# EAGLE schematic schematic (EAGLE 6.5.0)
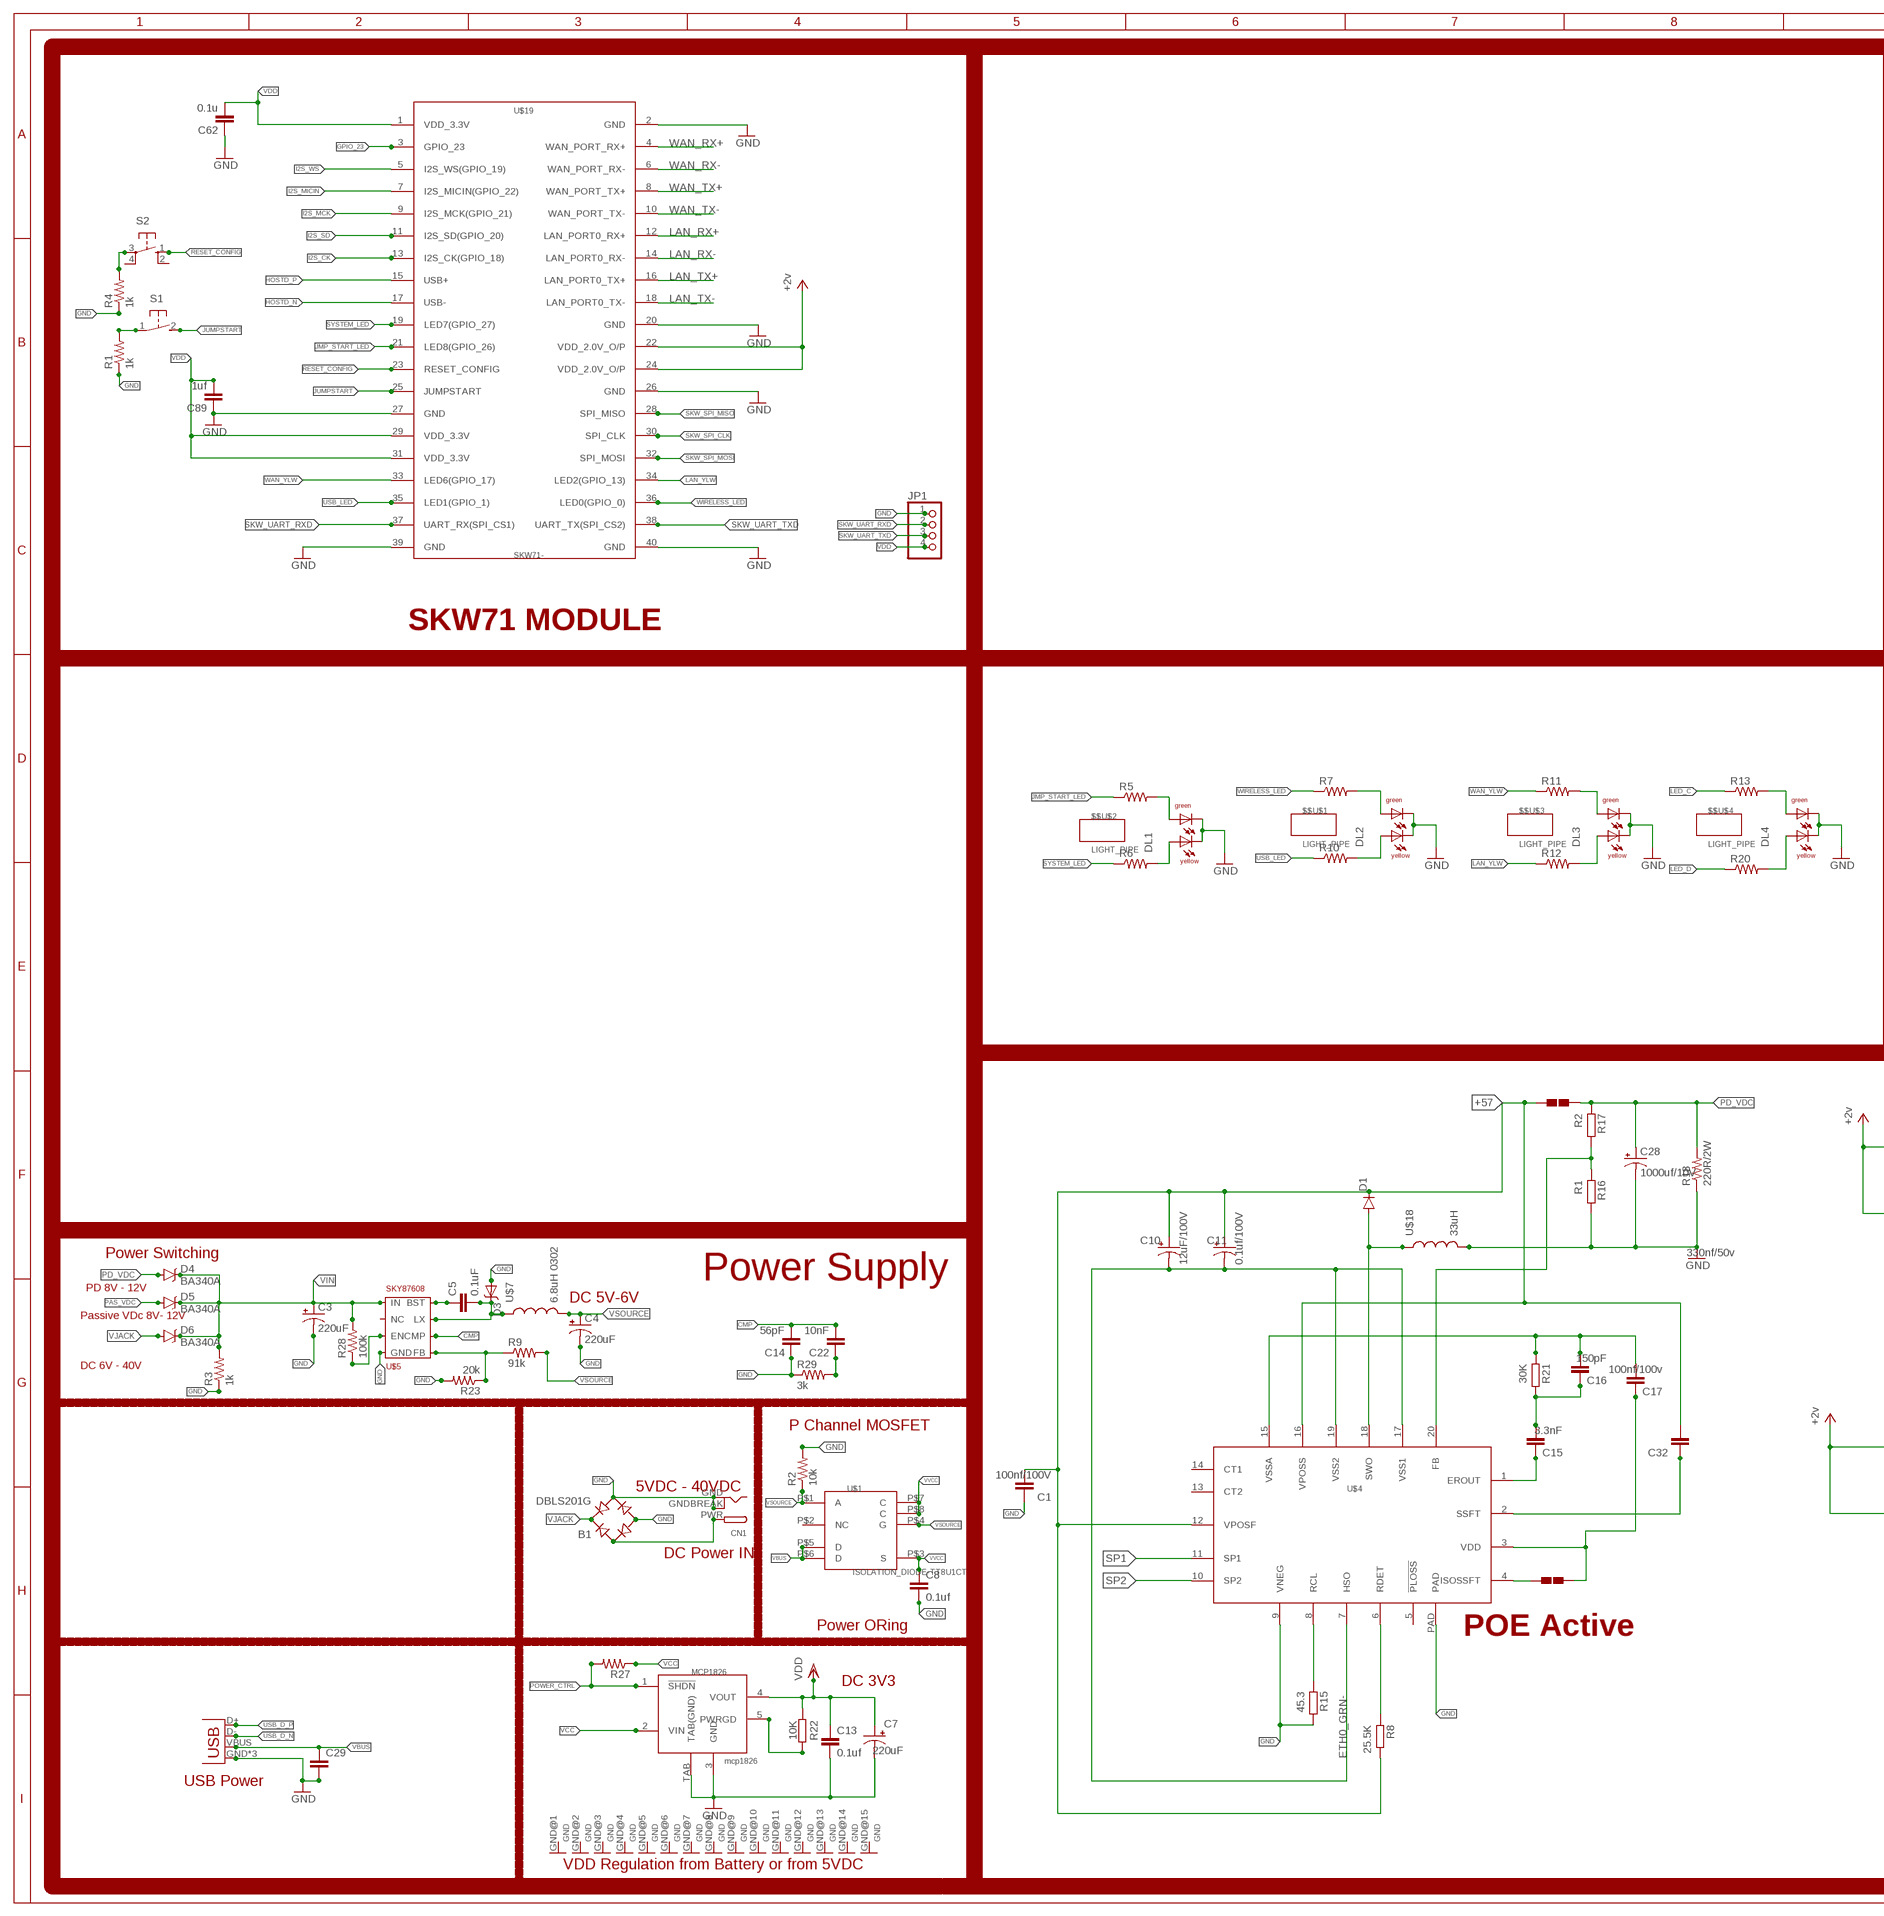
[diagram p0: schematic, sheet 1, part 1 of 2]
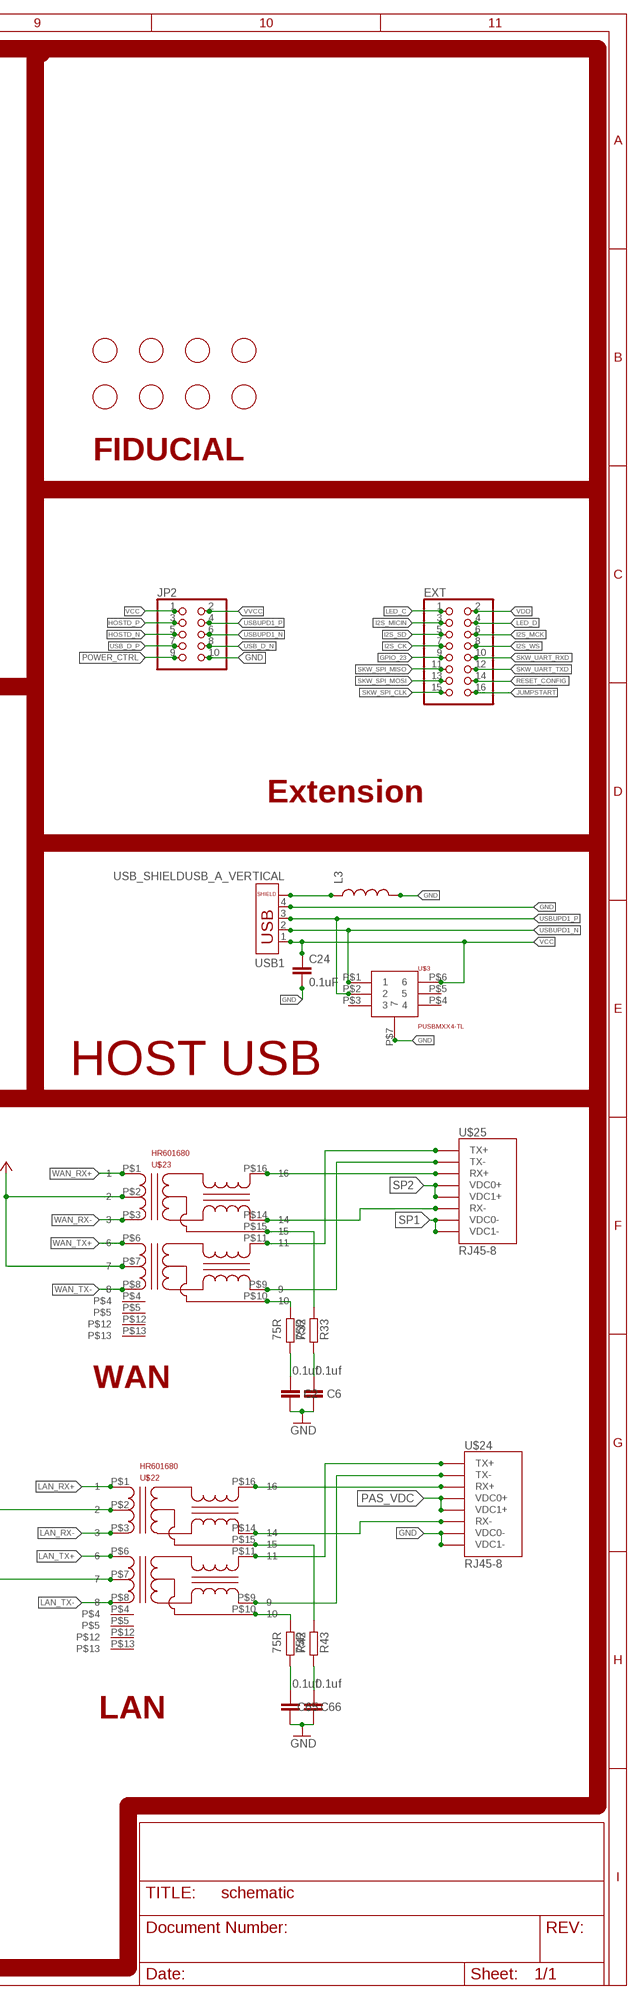
[diagram p1: schematic, sheet 1, part 2 of 2]

## Parts
$$U$1  LIGHT_PIPE  [LIGHT-PIPE]
$$U$2  LIGHT_PIPE  [LIGHT-PIPE]
$$U$3  LIGHT_PIPE  [LIGHT-PIPE]
$$U$4  LIGHT_PIPE  [LIGHT-PIPE]
B1  DBLS201G  [DBS]
C1  100nf/100V  C-EUC0805  [C0805]
C2  0.1uf  CAPACITOR  [C0603]
C3  220uF  CPOL-USE3.5-10  [E3,5-10]
C4  220uF  CPOL-USE5-10.5  [E5-10,5]
C5  0.1uF  CAP0402-CAP  [0402-CAP]
C6  0.1uf  CAPACITOR  [C0603]
C7  220uF  CPOL-USE5-10.5  [E5-10,5]
C8  0.1uf  C-EUC0402  [C0402]
C10  12uF/100V  CPOL-USE2,5-6E  [E2,5-6E]
C11  0.1uf/100V  CPOL-USE2-5  [E2-5]
C13  0.1uf  C-EUC0402  [C0402]
C14  56pF  CAP0402-CAP  [0402-CAP]
C15  3.3nF  C-EUC0805  [C0805]
C16  150pF  C-EUC0805  [C0805]
C17  100nf/100v  C-EUC0805  [C0805]
C22  10nF  CAP0402-CAP  [0402-CAP]
C24  0.1uF  CAP0402-CAP  [0402-CAP]
C28  1000uf/10V  CPOL-USE5-13  [E5-13]
C29  CAP0402-CAP  [0402-CAP]
C32  330nf/50v  C-EUC0805  [C0805]
C62  0.1u  CAPACITOR  [C0603]
C65  0.1uf  CAPACITOR  [C0603]
C66  0.1uf  CAPACITOR  [C0603]
C89  1uf  CAPACITOR  [C0603]
CN1  DCBARRELPTH  [DCJACK_2MM_PTH]
D1  DIODESMC/DO-214AB  [SMC]
D3  DIODE-SCHOTTKY_  [SMA-DIODE]
D4  BA340A  B340A  [SMA-DIODE]
D5  BA340A  B340A  [SMA-DIODE]
D6  BA340A  B340A  [SMA-DIODE]
DL1  DUOLED-1X2  [DUOLED-C-0603]
DL2  DUOLED-1X2  [DUOLED-C-0603]
DL3  DUOLED-1X2  [DUOLED-C-0603]
DL4  DUOLED-1X2  [DUOLED-C-0603]
EXT  PINHD-2X8  [2X08]
JP1  PINHD-1X4  [1X04]
JP2  PINHD-2X5  [2X05]
JP4  USB-MICROB  [USB-MICROB]
L3  INDUCTOR0402  [C0402]
MCP1826  mcp1826  MCP1825T  [SOT223-5]
R1  1k  RESISTOR0402-RES  [0402-RES]
R2  10k  RESISTOR0402-RES  [0402-RES]
R3  1k  RESISTOR0402-RES  [0402-RES]
R4  1k  RESISTOR0402-RES  [0402-RES]
R5  RESISTOR0402-RES  [0402-RES]
R6  RESISTOR0402-RES  [0402-RES]
R7  RESISTOR0402-RES  [0402-RES]
R8  25.5K  RESISTOR  [R0603]
R9  91k  RESISTOR0402-RES  [0402-RES]
R10  RESISTOR0402-RES  [0402-RES]
R11  RESISTOR0402-RES  [0402-RES]
R12  RESISTOR0402-RES  [0402-RES]
R13  RESISTOR0402-RES  [0402-RES]
R15  45.3  RESISTOR  [R0603]
R16  R1  RESISTOR  [R0603]
R17  R2  RESISTOR  [R0603]
R18  220R/2W  R-US_R2512  [R2512]
R20  RESISTOR0402-RES  [0402-RES]
R21  30K  RESISTOR  [R0603]
R22  10K  R-EU_R0402  [R0402]
R23  20k  RESISTOR0402-RES  [0402-RES]
R27  RESISTOR0402-RES  [0402-RES]
R28  100k  RESISTOR0402-RES  [0402-RES]
R29  3k  RESISTOR0402-RES  [0402-RES]
R32  75R  RESISTOR  [R0603]
R33  75R  RESISTOR  [R0603]
R42  75R  RESISTOR  [R0603]
R43  75R  RESISTOR  [R0603]
S1  31-XX  [B3F-31XX]
S2  10-XX  [B3F-10XX]
U$1  ISOLATION_DIODE-TT8U1CT  [8-TSST]
U$3  PUSBMXX4-TL  [PUSBMXX4-TL]
U$4  SI3402  [SI3402]
U$5  SKY87608  [8PIN-SOP-8L-EP]
U$7  6.8uH 0302  INDUCTORBOURNS_SRN6045  [SRN6045]
U$9  FIDUCIAL  [FIDUCIAL_1MM]
U$10  SOL-PAD-OPEN  [SOL-PAD-OPEN]
U$11  FIDUCIAL  [FIDUCIAL_1MM]
U$12  FIDUCIAL  [FIDUCIAL_1MM]
U$13  FIDUCIAL  [FIDUCIAL_1MM]
U$14  FIDUCIAL  [FIDUCIAL_1MM]
U$15  FIDUCIAL  [FIDUCIAL_1MM]
U$16  FIDUCIAL  [FIDUCIAL_1MM]
U$17  FIDUCIAL  [FIDUCIAL_1MM]
U$18  33uH  INDUCTOR  [INDUCTOR-10X9.8X6]
U$19  SKW71-  [SKW71-SMT]
U$22  HR601680  [SOIC-16]
U$23  HR601680  [SOIC-16]
U$24  RJ45-8  [RJHSE-5080-ND]
U$25  RJ45-8  [RJHSE-5080-ND]
U$28  SOL-PAD-OPEN  [SOL-PAD-OPEN]
USB1  USB_SHIELDUSB_A_VERTICAL  [USB_A_VERTICAL_PTH]

## Nets
+2V [power]: U$19.22(VDD_2.0V_O/P) U$19.24(VDD_2.0V_O/P) U$22.P$2 U$22.P$7 U$23.P$2 U$23.P$7 ; supply symbol labelled +2v
+57 [power]: C1.2 C10.+ C11.+ C32.2 D1.C R8.2 U$4.12(VPOSF) U$4.16(VPOSS) U$28.P$1
CMP: C14.2 C22.2 U$5.P$6(CMP)
ETH0_GRN-: C10.- C11.- U$4.7(HSO) U$4.17(VSS1) U$4.19(VSS2)
GND: B1.- B1.AC2 C1.1 C2.1 C3.- C4.- C6.1 C7.- C8.2 C13.2 C14.1 C24.2 C28.- C29.2 C62.1 C65.1 C66.1 C89.1 CN1.GND CN1.GNDBREAK D3.A DL1.C1 DL1.C2 DL2.C1 DL2.C2 DL3.C1 DL3.C2 DL4.C1 DL4.C2 JP1.1 JP2.10 JP4.GND JP4.MT1(GND) JP4.MT2(GND) L3.2 MCP1826.3(GND) MCP1826.TAB(TAB(GND)) R1.1 R2.2 R3.1 R4.1 R15.2 R16.2 R18.1 R23.2 R29.1 U$3.P$7 U$4.9(VNEG) U$4.PAD U$5.P$4(GND) U$18.P$2 U$19.2(GND) U$19.20(GND) U$19.26(GND) U$19.27(GND) U$19.39(GND) U$19.40(GND) U$24.P$7(VDC0-) U$24.P$8(VDC1-) USB1.4
GPIO_23: EXT.9 U$19.3(GPIO_23)
HOSTD_N: JP2.5 U$19.17(USB-)
HOSTD_P: JP2.3 U$19.15(USB+)
I2S_CK: EXT.7 U$19.13(I2S_CK(GPIO_18))
I2S_MCK: EXT.6 U$19.9(I2S_MCK(GPIO_21))
I2S_MICIN: EXT.3 U$19.7(I2S_MICIN(GPIO_22))
I2S_SD: EXT.5 U$19.11(I2S_SD(GPIO_20))
I2S_WS: EXT.8 U$19.5(I2S_WS(GPIO_19))
JMP_START_LED: R5.1 U$19.21(LED8(GPIO_26))
JUMPSTART: EXT.16 S1.2(S) U$19.25(JUMPSTART)
LAN_RX+: U$19.12(LAN_PORT0_RX+) U$22.P$1
LAN_RX-: U$19.14(LAN_PORT0_RX-) U$22.P$3
LAN_TX+: U$19.16(LAN_PORT0_TX+) U$22.P$6
LAN_TX-: U$19.18(LAN_PORT0_TX-) U$22.P$8
LAN_YLW: R12.1 U$19.34(LED2(GPIO_13))
LED_C: EXT.1 R13.1
LED_D: EXT.4 R20.1
N$1: DL2.A1 R7.2
N$2: C5.2 D3.C U$5.P$2(LX) U$7.1
N$3: DL1.A1 R5.2
N$4: DL2.A2 R10.2
N$5: R1.2 S1.1(P)
N$6: C16.2 C17.2 R21.1 U$4.15(VSSA)
N$7: C15.2 C16.1 R21.2
N$8: R8.1 U$4.6(RDET)
N$9: R15.1 U$4.8(RCL)
N$10: R4.2 S2.3(P)
N$11: U$4.4(ISOSSFT) U$10.P$1
N$12: C17.1 U$4.3(VDD) U$10.P$2
N$13: C15.1 U$4.1(EROUT)
N$15: C32.1 U$4.2(SSFT)
N$16: R16.1 R17.2 U$4.20(FB)
N$17: DL3.A2 R12.2
N$19: DL4.A1 R13.2
N$20: MCP1826.5(PWRGD) R22.2
N$22: R28.1 U$5.P$7(EN)
N$26: C5.1 U$5.P$8(BST)
N$27: R9.1 R23.1 U$5.P$5(FB)
N$29: DL4.A2 R20.2
N$35: DL3.A1 R11.2
N$37: C22.1 R29.2
N$38: D1.A U$4.18(SWO) U$18.P$1
N$40: DL1.A2 R6.2
N$41: L3.1 USB1.P$3
N$43: C2.2 R32.2
N$44: B1.AC1 CN1.PWR
N$45: C6.2 R33.2
N$48: U$23.P$16 U$25.P$3(RX+)
N$49: U$23.P$14 U$25.P$6(RX-)
N$50: R33.1 U$23.P$15
N$51: U$23.P$11 U$25.P$1(TX+)
N$52: U$23.P$9 U$25.P$2(TX-)
N$53: R32.1 U$23.P$10
N$54: R42.1 U$22.P$10
N$55: U$22.P$9 U$24.P$2(TX-)
N$56: U$22.P$11 U$24.P$1(TX+)
N$57: R43.1 U$22.P$15
N$58: U$22.P$14 U$24.P$6(RX-)
N$59: U$22.P$16 U$24.P$3(RX+)
N$69: C65.2 R42.2
N$70: C66.2 R43.2
PAS_VDC: D5.A U$24.P$4(VDC0+) U$24.P$5(VDC1+)
PD_VDC: C28.+ D4.A R17.1 R18.2 U$28.P$2
POWER_CTRL: JP2.9 MCP1826.1(!SHDN) R27.2
RESET_CONFIG: EXT.14 S2.1(S) U$19.23(RESET_CONFIG)
SKW_SPI_CLK: EXT.15 U$19.30(SPI_CLK)
SKW_SPI_MISO: EXT.11 U$19.28(SPI_MISO)
SKW_SPI_MOSI: EXT.13 U$19.32(SPI_MOSI)
SKW_UART_RXD: EXT.10 JP1.2 U$19.37(UART_RX(SPI_CS1))
SKW_UART_TXD: EXT.12 JP1.3 U$19.38(UART_TX(SPI_CS2))
SP1: U$4.11(SP1) U$25.P$7(VDC0-) U$25.P$8(VDC1-)
SP2: U$4.10(SP2) U$25.P$4(VDC0+) U$25.P$5(VDC1+)
SYSTEM_LED: R6.1 U$19.19(LED7(GPIO_27))
USB_D_N: JP2.8 JP4.D-
USB_D_P: JP2.7 JP4.D+
USB_LED: R10.1 U$19.35(LED1(GPIO_1))
USBUPD1_N: JP2.6 U$3.P$1 USB1.2
USBUPD1_P: JP2.4 U$3.P$2 USB1.3
VBUS: C29.1 JP4.VBUS U$1.P$5(D) U$1.P$6(D)
VCC: C24.1 JP2.1 MCP1826.2(VIN) R27.1 U$3.P$6 USB1.1
VDD: C7.+ C13.1 C62.2 C89.2 EXT.2 JP1.4 MCP1826.4(VOUT) R22.1 U$19.1(VDD_3.3V) U$19.29(VDD_3.3V) U$19.31(VDD_3.3V)
VIN: C3.+ D4.C D5.C D6.C R3.2 R28.2 U$5.P$1(IN)
VJACK: B1.+ D6.A
VSOURCE: C4.+ R2.1 R9.2 U$1.P$1(A) U$1.P$4(G) U$7.2
VVCC: C8.1 JP2.2 U$1.P$3(S) U$1.P$7(C) U$1.P$8(C)
WAN_RX+: U$19.4(WAN_PORT_RX+) U$23.P$1
WAN_RX-: U$19.6(WAN_PORT_RX-) U$23.P$3
WAN_TX+: U$19.8(WAN_PORT_TX+) U$23.P$6
WAN_TX-: U$19.10(WAN_PORT_TX-) U$23.P$8
WAN_YLW: R11.1 U$19.33(LED6(GPIO_17))
WIRELESS_LED: R7.1 U$19.36(LED0(GPIO_0))
Unconnected: S2.2(S1) S2.4(P1) U$1.P$2(NC) U$3.P$3 U$3.P$4 U$3.P$5 U$4.5(!PLOSS) U$4.13(CT2) U$4.14(CT1) U$5.P$3(NC) U$22.P$4 U$22.P$5 U$22.P$12 U$22.P$13 U$23.P$4 U$23.P$5 U$23.P$12 U$23.P$13

## Notes on the sheet
- FIDUCIAL
- SKW71 MODULE
- Extension
- HOST USB
- Power Switching
- Power Supply
- PD 8V - 12V
- DC 5V-6V
- Passive VDc 8V- 12V
- WAN
- DC 6V - 40V
- P Channel MOSFET
- 5VDC - 40VDC
- DC Power IN
- Power ORing
- POE Active
- LAN
- DC 3V3
- USB Power
- VDD Regulation from Battery or from 5VDC

## Power pins joined to a net without a drawn wire
GND: MCP1826.GND@1(GND) MCP1826.GND@2(GND) MCP1826.GND@3(GND) MCP1826.GND@4(GND) MCP1826.GND@5(GND) MCP1826.GND@6(GND) MCP1826.GND@7(GND) MCP1826.GND@8(GND) MCP1826.GND@9(GND) MCP1826.GND@10(GND) MCP1826.GND@11(GND) MCP1826.GND@12(GND) MCP1826.GND@13(GND) MCP1826.GND@14(GND) MCP1826.GND@15(GND)

## Library data of the parts
$$U$1-$$U$4 = BaseApp:LIGHT_PIPE: Digikey No :- __492-1313-ND__
B1 = rectifier:DB?*G: Single Phase 1.0 AMP Glass Passivated Bridge Rectifier Taiwan Semiconductor Co.,Ltd. - TSC Source: http://www.taiwansemi.com/TSCbig5/ezcatfiles/cust/img/img/db101g.pdf http://www.ts.com.tw/db/pictures/modules/PDT/PDT060207001/DBLS201G.pdf
C1 C8 C13 C15-C17 C32 = rcl:C-EU: CAPACITOR, European symbol
C2 C6 C62 C65 C66 C89 = BaseApp:CAPACITOR: C0402 & C0603 are general chip capacitors Film Capacitor, 400V's Mouser Part No :- __ECQ-E4474KF__
C3 C4 = schematic:CPOL-US: POLARIZED CAPACITOR, American symbol
C5 C14 C22 C24 C29 = SparkFun-Capacitors:CAP: Capacitor Standard 0603 ceramic capacitor, and 0.1" leaded capacitor.
C7 C11 C28 = adafruit:CPOL-US: POLARIZED CAPACITOR, American symbol
C10 = adafruit2:CPOL-US: POLARIZED CAPACITOR, American symbol
CN1 = adafruit:DCBARREL: 2.0mm DC Barrel Jack DCJACK_2MM_PTH - Through Hole Jack (4UConnector: 05537)
D1 = SparkFun-DiscreteSemi:DIODE: Diode These are standard reverse protection diodes and small signal diodes. SMA package can handle up to about 1A. SOD-323 can handle about 200mA. What the SOD-323 package when ordering, there are some mfgs out there that are 5-pin packages.
D3 = schematic:DIODE-SCHOTTKY
D4-D6 = SparkFun-DiscreteSemi:B340A: Schottky Diode 3A-40V; PROD_ID: DIO-09886
DL1-DL4 = BaseApp:DUOLED-1X2: Digikey No :- __754-1146-1-ND__
EXT = pinhead:PINHD-2X8: PIN HEADER
JP1 = pinhead:PINHD-1X4: PIN HEADER
JP2 = pinhead:PINHD-2X5: PIN HEADER
JP4 = SparkFun-Connectors:USB: USB Connectors USB-B-PTH is fully proven SKU : PRT-00139/CONN-08278 USB-miniB is fully proven SKU : PRT-00587 USB-A-PCB is untested. USB-A-H is throughly reviewed, but untested. Spark Fun Electronics SKU : PRT-00437 USB-B-SMT is throughly reviewed, but untested. Needs silkscreen touching up. USB-A-S has not been used/tested USB-MB-H has not been used/tested USB-MICROB has been used. CONN-09505; PROD_ID: CONN-09505
L3 = SparkFun-Passives:INDUCTOR: Inductors Basic Inductor/Choke - 0603 and 1206. Footprints are not proven and vary greatly between part numbers. SRN6045- 33uH, 20% 1.4A SDR0403-560KL - 56uH, 10%, 500mA RMS/740mA peak
MCP1826 = BaseApp:MCP1825T: Digikey No:- __MCP1825T-5002E/DCCT-ND__
R1-R4 R9 R23 R27-R29 = SparkFun-Passives:RESISTOR: Resistor Basic schematic elements and footprints for 0603, 1206, and PTH resistors.
R5-R7 R10-R13 R20 = SparkFun:RESISTOR: Resistor Basic schematic elements and footprints for 0603, 1206, and PTH resistors.
R8 R15-R17 R21 R32 R33 R42 R43 = BaseApp:RESISTOR: Resistance Package :- 0603 Mount :-Surface mount
R18 = adafruit:R-US_: RESISTOR, American symbol
R22 = resistor:R-EU_: RESISTOR, European symbol
S1 = switch-omron:31-XX: OMRON SWITCH; MPN: B3F-3100; OC_FARNELL: 959704; OC_NEWARK: 36M3582
S2 = switch-omron:10-XX: OMRON SWITCH; MPN: B3F-1000; OC_FARNELL: 176432; OC_NEWARK: 36M3542
U$1 = BaseApp:ISOLATION_DIODE: Digikey No :- __FDFMA2P857CT-ND__ (6-WDFN). Digikey No :- __TT8U1CT-ND__ (8TSST).Note- The NC pin connects to the A pin
U$3 = schematic:PUSBMXX4-TL
U$4 = BaseApp:SI3402: FULLY-INTEGRATED 802.3-COMPLIANT POE PD INTERFACE AND LOW-EMI SWITCHING REGULATOR
U$5 = schematic:SKY87608
U$7 = SparkFun-Passives:INDUCTOR: Inductors Basic Inductor/Choke - 0603 and 1206. Footprints are not proven and vary greatly between part numbers. SRN6045- 33uH, 20% 1.4A SDR0403-560KL - 56uH, 10%, 500mA RMS/740mA peak; PROD_ID: NDUC-11627; VALUE: 33uH
U$9 U$11-U$17 = adafruit:FIDUCIAL: For use by pick and place machines to calibrate the vision/machine, 1mm By microbuilder.eu
U$10 U$28 = BaseApp:SOL-PAD-OPEN
U$18 = BaseApp:INDUCTOR
U$19 = BaseApp:SKW71
U$22 U$23 = schematic:HR601680
U$24 U$25 = schematic:RJ45-8: RJ45 Jack Simple RJ45, 8-pin connection - connector for common Cat5, Cat5e, and Cat6 Ethernet cables. Footprint not yet proven in production. Connector sku is PRT-00643; Breakout PCB sku is BOB-00716.
USB1 = schematic:USB_SHIELD

## Net classes
0 default: width 0.203 mm, drill 0.305 mm, clearance 0.152 mm
1 power: width 0.203 mm, drill 0.305 mm, clearance 0.152 mm
2 gnd: width 0.203 mm, drill 0.305 mm, clearance 0.152 mm